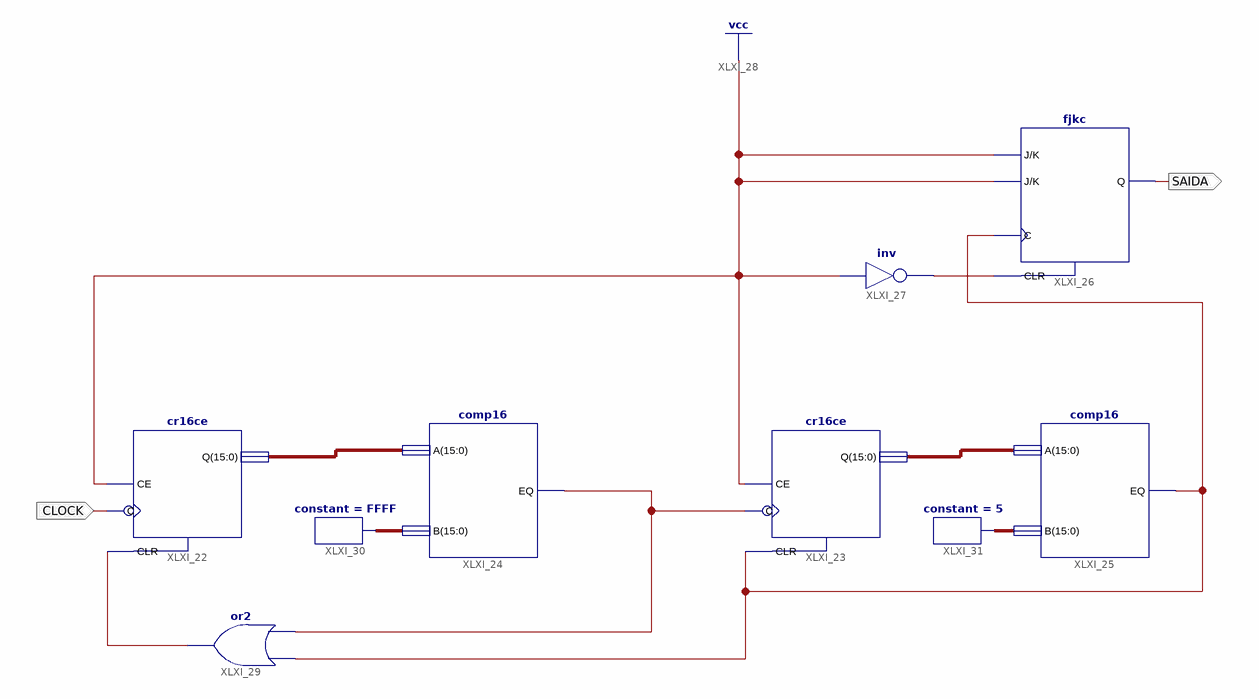
[diagram p0: schematic sheet 1]
// Xilinx ISE schematic DivisorFreqDisplay.sch (spartan3) as structural Verilog: 9 symbols, 2 ports
module DivisorFreqDisplay (
  input  CLOCK,
  output SAIDA
);

  wire XLXN_24, XLXN_27, XLXN_31, XLXN_35;
  wire [15:0] XLXN_23, XLXN_25, XLXN_36, XLXN_37;

  cr16ce XLXI_22 (.C(CLOCK), .CE(1'b1), .CLR(XLXN_35), .Q(XLXN_23));
  cr16ce XLXI_23 (.C(XLXN_24), .CE(1'b1), .CLR(XLXN_31), .Q(XLXN_25));
  comp16 XLXI_24 (.A(XLXN_23), .B(XLXN_36), .EQ(XLXN_24));
  comp16 XLXI_25 (.A(XLXN_25), .B(XLXN_37), .EQ(XLXN_31));
  fjkc XLXI_26 (.C(XLXN_31), .CLR(XLXN_27), .J(1'b1), .K(1'b1), .Q(SAIDA));
  not XLXI_27 (XLXN_27, 1'b1);
  or XLXI_29 (XLXN_35, XLXN_24, XLXN_31);
  constant #(.CValue("FFFF")) XLXI_30 (.O(XLXN_36));
  constant #(.CValue("5")) XLXI_31 (.O(XLXN_37));
endmodule
